# Altium schematic sheet MCU.SchDoc
size Tabloid
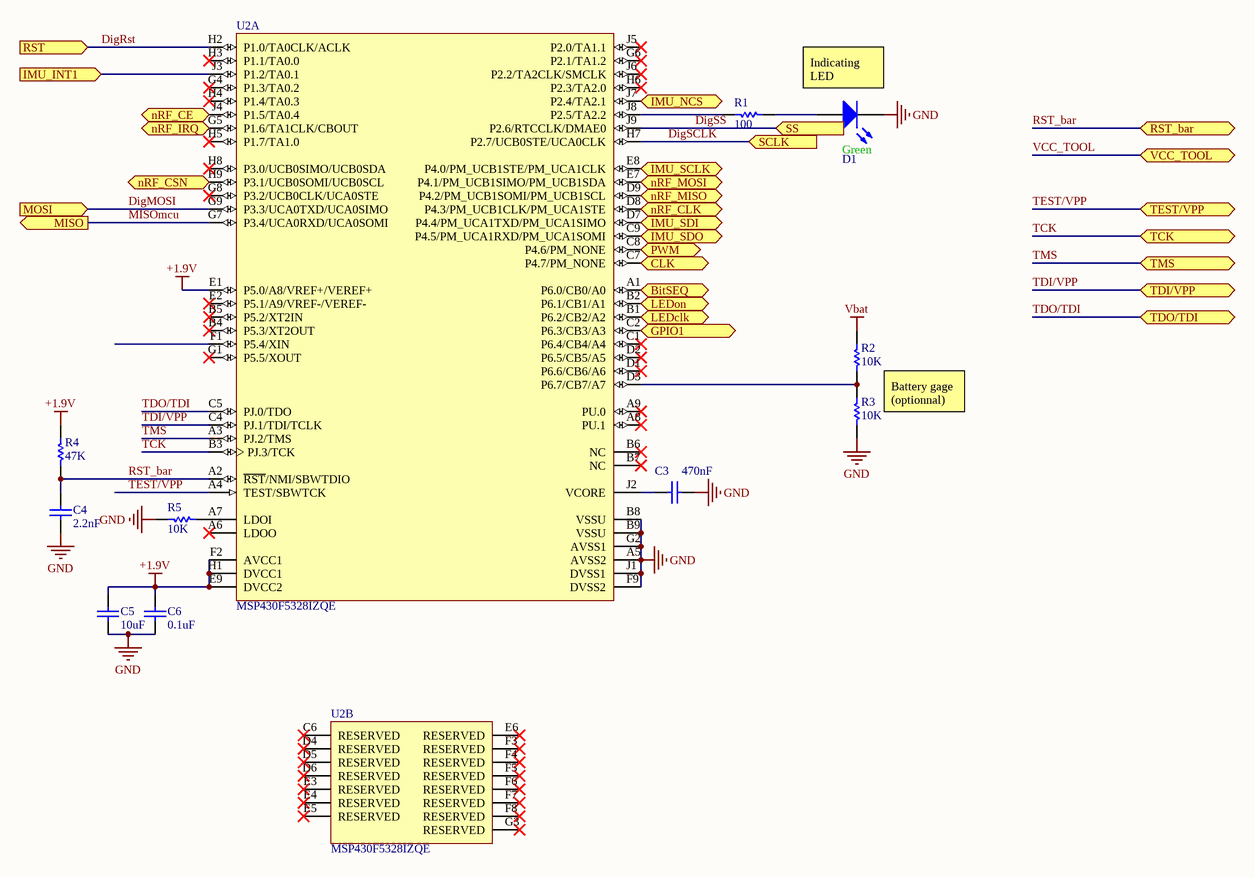
[diagram p0: MCU.SchDoc]

## Parts
C3  value 470nF  [0201_Custom]
C4  value 2.2nF  [0201_Custom]
C5  value 10uF  [0402]
C6  value 0.1uF  [0201_Custom]
D1  Color: Green  [0402]
R1  value 100  [0201_Custom]
R2  value 10K  [0201_Custom]
R3  value 10K  [0201_Custom]
R4  value 47K  [0201_Custom]
R5  value 10K  [0201_Custom]
U2  MSP430F5328IZQE  [TI-ZQE80]  (parts A,B of 2)

## Ports
BitSEQ (in), CLK (out), GPIO1 (bidir), IMU_INT1 (in), IMU_NCS (out), IMU_SCLK (in), IMU_SDI (out), IMU_SDO (in), LEDclk (in), LEDon (in), MISO (out), MOSI (in), nRF_CE (out), nRF_CLK (out), nRF_CSN (out), nRF_IRQ (in), nRF_MISO (in), nRF_MOSI (out), PWM (out), RST (in), RST_bar (bidir), SCLK (in), SS (in), TCK (bidir), TDI/VPP (bidir), TDO/TDI (bidir), TEST/VPP (bidir), TMS (bidir), VCC_TOOL (bidir)

## Nets
+1.9V: C5.2 C6.2 R4.1 U2.E1(P5.0/A8/VREF+/VEREF+) U2.E9(DVCC2) U2.F2(AVCC1) U2.H1(DVCC1)
GND: C3.1 C4.2 C5.1 C6.1 D1.2(K) R3.2 R5.2 U2.A5(AVSS2) U2.B8(VSSU) U2.B9(VSSU) U2.F9(DVSS2) U2.G2(AVSS1) U2.J1(DVSS1)
Vbat: R2.1
BitSEQ: U2.A1(P6.0/CB0/A0) ; port BitSEQ
CLK: U2.C7(P4.7/PM_NONE) ; port CLK
DigMOSI: U2.G9(P3.3/UCA0TXD/UCA0SIMO) ; port MOSI
DigRst: U2.H2(P1.0/TA0CLK/ACLK) ; port RST
DigSCLK: U2.H7(P2.7/UCB0STE/UCA0CLK) ; port SCLK
DigSS: U2.J9(P2.6/RTCCLK/DMAE0) ; port SS
GPIO1: U2.C2(P6.3/CB3/A3) ; port GPIO1
IMU_INT1: U2.J3(P1.2/TA0.1) ; port IMU_INT1
IMU_NCS: U2.J7(P2.4/TA2.1) ; port IMU_NCS
IMU_SCLK: U2.E8(P4.0/PM_UCB1STE/PM_UCA1CLK) ; port IMU_SCLK
IMU_SDI: U2.D7(P4.4/PM_UCA1TXD/PM_UCA1SIMO) ; port IMU_SDI
IMU_SDO: U2.C9(P4.5/PM_UCA1RXD/PM_UCA1SOMI) ; port IMU_SDO
LEDclk: U2.B1(P6.2/CB2/A2) ; port LEDclk
LEDon: U2.B2(P6.1/CB1/A1) ; port LEDon
MISOmcu: U2.G7(P3.4/UCA0RXD/UCA0SOMI) ; port MISO
nRF_CE: U2.J4(P1.5/TA0.4) ; port nRF_CE
nRF_CLK: U2.D8(P4.3/PM_UCB1CLK/PM_UCA1STE) ; port nRF_CLK
nRF_CSN: U2.H9(P3.1/UCB0SOMI/UCB0SCL) ; port nRF_CSN
nRF_IRQ: U2.G5(P1.6/TA1CLK/CBOUT) ; port nRF_IRQ
nRF_MISO: U2.D9(P4.2/PM_UCB1SOMI/PM_UCB1SCL) ; port nRF_MISO
nRF_MOSI: U2.E7(P4.1/PM_UCB1SIMO/PM_UCB1SDA) ; port nRF_MOSI
PWM: U2.C8(P4.6/PM_NONE) ; port PWM
RST_bar: C4.1 R4.2 U2.A2(~{RST}/NMI/SBWTDIO) ; port RST_bar
TCK: U2.B3(PJ.3/TCK) ; port TCK
TDI/VPP: U2.C4(PJ.1/TDI/TCLK) ; port TDI/VPP
TDO/TDI: U2.C5(PJ.0/TDO) ; port TDO/TDI
TEST/VPP: U2.A4(TEST/SBWTCK) ; port TEST/VPP
TMS: U2.A3(PJ.2/TMS) ; port TMS
VCC_TOOL: port VCC_TOOL
NetC3_2: C3.2 U2.J2(VCORE)
NetD1_1: D1.1(A) R1.1
NetR1_2: R1.2 U2.J8(P2.5/TA2.2)
NetR2_2: R2.2 R3.1 U2.D3(P6.7/CB7/A7)
NetR5_1: R5.1 U2.A7(LDOI)

Not connected (* = marked no-connect by the designer): U2 A6(LDOO)* A8(PU.1)* A9(PU.0)* B4(P5.3/XT2OUT)* B5(P5.2/XT2IN)* B6(NC)* B7(NC)* C1(P6.4/CB4/A4)* C6(RESERVED)* D1(P6.6/CB6/A6)* D2(P6.5/CB5/A5)* D4(RESERVED)* D5(RESERVED)* D6(RESERVED)* E2(P5.1/A9/VREF-/VEREF-)* E3(RESERVED)* E4(RESERVED)* E5(RESERVED)* E6(RESERVED)* F1(P5.4/XIN) F3(RESERVED)* F4(RESERVED)* F5(RESERVED)* F6(RESERVED)* F7(RESERVED)* F8(RESERVED)* G1(P5.5/XOUT)* G3(RESERVED)* G4(P1.3/TA0.2)* G6(P2.1/TA1.2)* G8(P3.2/UCB0CLK/UCA0STE)* H3(P1.1/TA0.0)* H4(P1.4/TA0.3)* H5(P1.7/TA1.0)* H6(P2.3/TA2.0)* H8(P3.0/UCB0SIMO/UCB0SDA)* J5(P2.0/TA1.1)* J6(P2.2/TA2CLK/SMCLK)*

## Notes on the sheet
- (near D1) Indicating LED
- Battery gage (optionnal)

## Library data of the parts
C3-C6 = Cap Semi: Capacitor (Semiconductor SIM Model); Published: 8-Jun-2000; LatestRevisionDate: 29-May-2009; LatestRevisionNote: IPC-7351 Footprint Added.; PackageReference: C1206; Publisher: Altium Limited; PackageDescription: Chip Capacitor
D1 = LED3: Typical BLUE SiC LED; Published: 8-Jun-2000; LatestRevisionDate: 17-Dec-2003; LatestRevisionNote: PCB Footprint replaced.; DatasheetVersion: 16-Apr-2002; PackageVersion: 16-Apr-2002; PackageReference: 3.5X2.8X1.9; Publisher: Altium Limited; PackageDescription: SM LED; 2 C-Bend Leads; Body 3.5 x 2.8 x 1.9 mm, inc leads (LxWxH typ)
R1-R5 = Res Semi: Semiconductor Resistor; Published: 8-Jun-2000; LatestRevisionDate: 17-Jul-2002; LatestRevisionNote: Re-released for DXP Platform.; PackageReference: AXIAL-0.5; Publisher: Altium Limited; PackageDescription: Axial Device, Thru-Hole; 2 Leads; 0.5 in Pin Spacing
U2 = MSP430F5328IZQE: 25 MHz Mixed Signal Microcontroller with 128 KB Flash, 10240 B SRAM and 48 GPIOs, -40 to 85 degC, 80-pin BGA (ZQE), Green (RoHS & no Sb/Br); Manufacturer: Texas Instruments; ADC: 12-bit SAR; ADC Channels: 16; Brown Out Reset: Yes; DMA: 3; Flash(KB): 128; Frequency(MHz): 25; GPIO: 48; Multiplier: 32x32; SRAM(B): 10240; SubFamily: 5 Series; Timers - 16-bit: 4; USCI_A (UART/LIN/IrDA/SPI): 2; DatasheetVersion: SLAS678C; PackageVersion: 4204334-6/G; PackageReference: ZQE80; PackageDescription: 80-Pin Plastic Ball Grid Array, Body 5 x 5 mm, Pitch 0.5 mm; Supplier 1: Digi-Key; Supplier Part Number 1: 296-30060-2-ND; Supplier 2: Digi-Key; Supplier Part Number 2: 296-30060-1-ND; Supplier 3: Digi-Key; Supplier Part Number 3: 296-30060-6-ND; Supplier 4: Farnell; Supplier Part Number 4: 2072181; Supplier 5: Newark; Supplier Part Number 5: 74T4608; Supplier 6: Newark; Supplier Part Number 6: 76T0384; Supplier 7: Mouser; Supplier Part Number 7: 595-MSP430F5328IRGCT; Comparators: Yes; Eco-Plan: Green (RoHS & no Sb/Br); Real-Time Clock: Yes; SVS: Yes; Temp Sensor: Yes; USCI_B (I2C & SPI): 2; Watchdog: Yes; Mounting Technology: Surface Mount; Code_JEDEC: MO-225; PartNumber: MSP430F5328IZQE; ComponentLink1Description: Manufacturer URL; ComponentLink1URL: http://www.ti.com/; ComponentLink2Description: Datasheet; ComponentLink2URL: http://www.ti.com/general/docs/lit/getliterature.tsp?genericPartNumber=MSP430F5328&fileType=pdf; ComponentLink3Description: Package Specification; ComponentLink3URL: http://www.ti.com/litv/pdf/mpbg269e